# Altium project practice1.PrjPcb
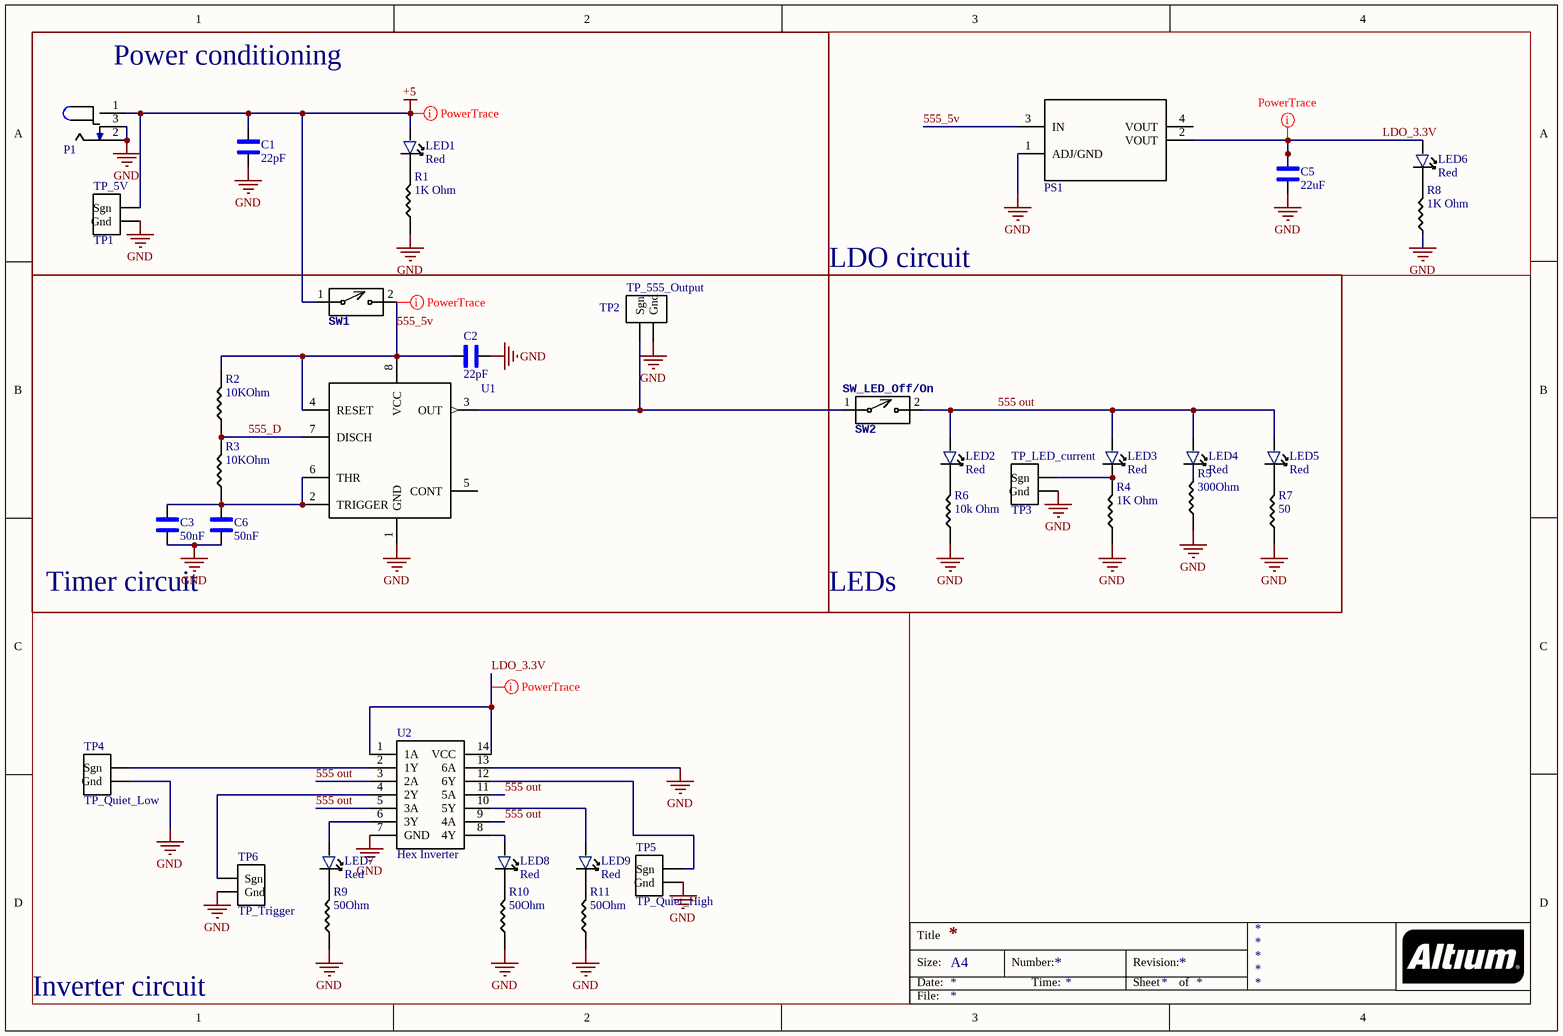
[diagram p0: Sheet1.SchDoc]
1 sheet, 37 parts. Net scope: global (net labels, ports and power ports of the same name join across sheets).
Board file: ECEN4720_brd1_2020-09-11.PcbDoc

## Sheet Sheet1.SchDoc
size A4

### Parts
C1  22pF  [1206_Passive]
C2  22pF  [1206_Passive]
C3  50nF  [1206_Passive]
C5  22uF  [1206_Passive]
C6  50nF  [1206_Passive]
LED1  value Red  [LED]  (hidden comment: LTST-C150CKT)
LED2  value Red  [LED]  (hidden comment: LTST-C150CKT)
LED3  value Red  [LED]  (hidden comment: LTST-C150CKT)
LED4  value Red  [LED]  (hidden comment: LTST-C150CKT)
LED5  value Red  [LED]  (hidden comment: LTST-C150CKT)
LED6  value Red  [LED]  (hidden comment: LTST-C150CKT)
LED7  value Red  [LED]  (hidden comment: LTST-C150CKT)
LED8  value Red  [LED]  (hidden comment: LTST-C150CKT)
LED9  value Red  [LED]  (hidden comment: LTST-C150CKT)
P1  Power Jack  [Power_Jack]  (value not drawn)
PS1  AZ1117CH-3.3TRG1  [LDO]  (value not drawn)
R1  value 1K Ohm  [1206_Passive]  (hidden comment: 1k)
R2  value 10KOhm  [1206_Passive]  (hidden comment: 10k)
R3  value 10KOhm  [1206_Passive]  (hidden comment: 10k)
R4  value 1K Ohm  [1206_Passive]  (hidden comment: 1k)
R5  value 300Ohm  [1206_Passive]  (hidden comment: 300)
R6  value 10k Ohm  [1206_Passive]  (hidden comment: 1M)
R7  value 50  [1206_Passive]  (hidden comment: 1M)
R8  value 1K Ohm  [1206_Passive]  (hidden comment: 1k)
R9  value 50Ohm  [1206_Passive]  (hidden comment: 50)
R10  value 50Ohm  [1206_Passive]  (hidden comment: 50)
R11  value 50Ohm  [1206_Passive]  (hidden comment: 50)
SW1  SW_2Pin_100mil_Switch  [2Pin-Header-Conn]  (value not drawn)
SW2  SW_LED_Off/On  [2Pin-Header-Conn]
TP1  TP_5V  [TP10x_Probe]
TP2  TP_555_Output  [TP10x_Probe]
TP3  TP_LED_current  [TP10x_Probe]
TP4  TP_Quiet_Low  [TP10x_Probe]
TP5  TP_Quiet_High  [TP10x_Probe]
TP6  TP_Trigger  [TP10x_Probe]
U1  U_555_Fast  [TS555IDTTR]  (value not drawn)
U2  Hex Inverter  [HEX_74LVT14D]

### Blocks framed on the sheet
Power conditioning: C1 LED1 P1 R1 TP1
LDO circuit: C5 LED6 PS1 R8
Timer circuit: C2 C3 C6 R2 R3 SW1 TP2 U1
LEDs: LED2-LED5 R4-R7 SW2 TP3
Inverter circuit: LED7-LED9 R9-R11 TP4-TP6 U2

### Nets
+5: C1.1 LED1.2 P1.1 SW1.1 TP1.1(Sgn)
GND: C1.2 C2.1 C3.1 C5.1 C6.1 P1.2 P1.3 PS1.1(ADJ/GND) R1.1 R4.1 R5.1 R6.1 R7.1 R8.1 R9.1 R10.1 R11.1 TP1.2(Gnd) TP2.2(Gnd) TP3.2(Gnd) TP4.2(Gnd) TP5.2(Gnd) TP6.2(Gnd) U1.1(GND) U2.7(GND) U2.13(6A)
555 out: LED2.2 LED3.2 LED4.2 LED5.2 SW2.2 U2.3(2A) U2.5(3A) U2.9(4A) U2.11(5A)
555_5v: C2.2 PS1.3(IN) R2.2 SW1.2 U1.4(RESET) U1.8(VCC)
555_D: R2.1 R3.2 U1.7(DISCH)
LDO_3.3V: C5.2 LED6.2 PS1.2(VOUT) U2.1(1A) U2.14(VCC)
NetC3_2: C3.2 C6.2 R3.1 U1.2(TRIGGER) U1.6(THR)
NetLED1_1: LED1.1 R1.2
NetLED2_1: LED2.1 R6.2
NetLED3_1: LED3.1 R4.2 TP3.1(Sgn)
NetLED4_1: LED4.1 R5.2
NetLED5_1: LED5.1 R7.2
NetLED6_1: LED6.1 R8.2
NetLED7_1: LED7.1 R9.2
NetLED7_2: LED7.2 U2.6(3Y)
NetLED8_1: LED8.1 R10.2
NetLED8_2: LED8.2 U2.8(4Y)
NetLED9_1: LED9.1 R11.2
NetLED9_2: LED9.2 U2.10(5Y)
NetSW2_1: SW2.1 TP2.1(Sgn) U1.3(OUT)
NetTP4_1: TP4.1(Sgn) U2.2(1Y)
NetTP5_1: TP5.1(Sgn) U2.12(6Y)
NetTP6_1: TP6.1(Sgn) U2.4(2Y)

Not connected (* = marked no-connect by the designer): PS1 4(VOUT); U1 5(CONT)

### Layout directives
rule Width Constraint [Pref Width = 20mil    Min Width = 10mil    Max Width = 100mil]: 555_5v, +5, LDO_3.3V
mark named PowerTrace: LDO_3.3V

### Notes on the sheet
- Title
- Size:
- Date:
- A4
- Number:
- Time:
- Revision:
- Sheet
- of
- File:

### Library data of the parts
C1 C2 = C_22pF_1206: 22pF ±5% 16V Ceramic Capacitor C0G, NP0 1206 (3216 Metric); Digikey Link: https://www.digikey.com/product-detail/en/885012008011/732-7867-1-ND/5454494/?itemSeq=304982362; Digikey Part: 732-7867-1-ND; Value: 22pF
C3 C6 = C_50nF_1206: 50nF ±5% 16V Ceramic Capacitor C0G, NP0 1206 (3216 Metric); Digikey Link: https://www.digikey.com/product-detail/en/885012008011/732-7867-1-ND/5454494/?itemSeq=304982362; Digikey Part: 732-7867-1-ND; Value: 50nF
C5 = C_22uF_1206: 22µF ±20% 16V Ceramic Capacitor X5R 1206 (3216 Metric); Digikey Link: https://www.digikey.com/product-detail/en/CL31A226MOCLNNC/1276-2728-1-ND/3890814/?itemSeq=304982363; Digikey Part: 1276-2728-1-ND; Value: 22uF
LED1-LED9 = LED_RED_1206: Red 638nm LED Indication - Discrete 1.8V 1206 (3216 Metric); Digikey Link: https://www.digikey.com/product-detail/en/LTST-C150CKT/160-1167-1-ND/269239/?itemSeq=304982368; Digikey Part: 160-1167-1-ND
P1 = P_Power Jack: Power Barrel Connector Jack 2.10mm ID (0.083"), 5.50mm OD (0.217") Through Hole, Right Angle; Value: CONN PWR JACK 2X5.5MM SOLDER; Digikey Link: https://www.digikey.com/product-detail/en/PJ-102A/CP-102A-ND/275425/?itemSeq=304982367; Digikey Part: CP-102A-ND
PS1 = PS_LDO_3v3: Linear Voltage Regulator IC Positive Fixed 1 Output 1A SOT-223; Value: IC REG LINEAR 3.3V 800MA SOT223; Digikey Link: https://www.digikey.com/product-detail/en/AZ1117CH-3.3TRG1/AZ1117CH-3.3TRG1DICT-ND/4505206/?itemSeq=304982370; Digikey Part: AZ1117CH-3.3TRG1DICT-ND
R1 R4 R8 = R_1K_1206: 1 kOhms ±1% 0.5W, 1/2W Chip Resistor 1206 (3216 Metric) Anti-Sulfur, Moisture Resistant Thin Film; Digikey Link: https://www.digikey.com/product-detail/en/RNCP1206FTD1K00/RNCP1206FTD1K00CT-ND/2240675/?itemSeq=304982373; Digikey Part: RNCP1206FTD1K00CT-ND
R2 R3 = R_10KOhm_1206: 10 kOhms ±5% 0.25W, 1/4W Chip Resistor 1206 (3216 Metric) Automotive AEC-Q200 Thick Film; Digikey Link: https://www.digikey.com/product-detail/en/RMCF1206JT300R/RMCF1206JT300RCT-ND/1942776/?itemSeq=304982374; Digikey Part: RMCF1206JT300RCT-ND
R5 = R_300Ohm_1206: 300 Ohms ±5% 0.25W, 1/4W Chip Resistor 1206 (3216 Metric) Automotive AEC-Q200 Thick Film; Digikey Link: https://www.digikey.com/product-detail/en/RMCF1206JT300R/RMCF1206JT300RCT-ND/1942776/?itemSeq=304982374; Digikey Part: RMCF1206JT300RCT-ND
R6 R7 = R_1M_1206: 1 MOhms ±5% 0.25W, 1/4W Chip Resistor 1206 (3216 Metric) Automotive AEC-Q200 Thick Film; Digikey Link: https://www.digikey.com/product-detail/en/RMCF1206JT1M00/RMCF1206JT1M00CT-ND/1942830/?itemSeq=304982358; Digikey Part: Number RMCF1206JT1M00CT-ND
R9-R11 = R_50Ohm_1206: 50 Ohms ±5% 0.25W, 1/4W Chip Resistor 1206 (3216 Metric) Automotive AEC-Q200 Thick Film; Digikey Link: https://www.digikey.com/product-detail/en/RMCF1206JT300R/RMCF1206JT300RCT-ND/1942776/?itemSeq=304982374; Digikey Part: RMCF1206JT300RCT-ND
SW1 SW2 = SW_2Pin_100mil_Switch: 2Pin Header
TP1-TP6 = TP_10x_Probe: Test Point 300 mil centers
U1 = U_555_Fast: 555 Type, Timer/Oscillator _Single_ IC 2.7MHz 8-SO; MF: STMicroelectronics; Availability: Unavailable; Package: SO-8 STMicroelectronics; MP: TS555IDTTR; DigiKey-Purchase-URL: https://snapeda.com/shop?store=DigiKey&id=1050007; SnapEDA_Link: https://www.snapeda.com/parts/TS555IDTTR/STMicroelectronics/view-part/1050007/?ref=snap; Value: *; Price: None
U2 = U_7414_LVTD_Hex: Inverter IC 6 Channel Schmitt Trigger 14-SOIC; Supplier 1: Digi-Key; ComponentLink1Description: New link; ComponentLink1URL: *